# Altium schematic sheet STM32.SchDoc
size A; SheetNumber: 4; SheetTotal: 5
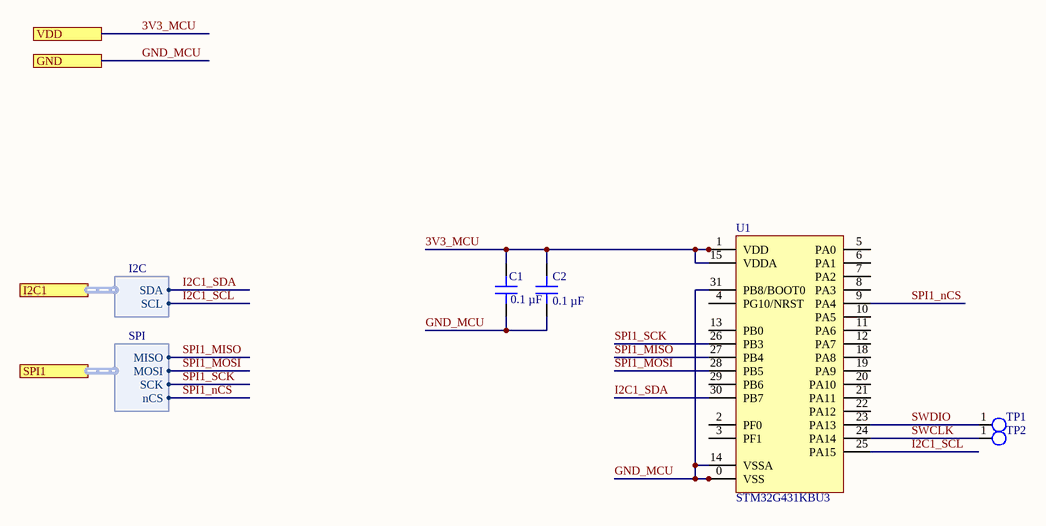
[diagram p0: STM32.SchDoc]

## Parts
C1  0.1 µF  [CAP 0402_1005]
C2  0.1 µF  [CAP 0402_1005]
TP1  0.8mm  [TP  0.8mm]  (value not drawn)
TP2  0.8mm  [TP  0.8mm]  (value not drawn)
U1  STM32G431KBU3  [QFN50P400X400X60-32N]

## Ports
GND, I2C1 (harness I2C), SPI1 (harness SPI), VDD

## Harnesses
I2C: SCL, SDA
SPI: MOSI, MISO, SCK, nCS

## Nets
3V3_MCU: C1.2 C2.2 U1.1(VDD) U1.15(VDDA) U1.17(VDD) ; port VDD
GND_MCU: C1.1 C2.1 U1.0(VSS) U1.14(VSSA) U1.16(VSS) U1.31(PB8/BOOT0) U1.32(VSS) ; port GND
I2C1_SCL: U1.25(PA15) ; port I2C1.SCL
I2C1_SDA: U1.30(PB7) ; port I2C1.SDA
SPI1_MISO: U1.27(PB4) ; port SPI1.MISO
SPI1_MOSI: U1.28(PB5) ; port SPI1.MOSI
SPI1_nCS: U1.9(PA4) ; port SPI1.nCS
SPI1_SCK: U1.26(PB3) ; port SPI1.SCK
SWCLK: TP2.1(TP) U1.24(PA14)
SWDIO: TP1.1(TP) U1.23(PA13)

Not connected (* = marked no-connect by the designer): U1 2(PF0) 3(PF1) 4(PG10/NRST) 5(PA0) 6(PA1) 7(PA2) 8(PA3) 10(PA5) 11(PA6) 12(PA7) 13(PB0) 18(PA8) 19(PA9) 20(PA10) 21(PA11) 22(PA12) 29(PB6)

## Library data of the parts
C1 C2 = C0402C104K4RACAUTO: CAP CER 0.1UF 16V X7R 0402; manufacturer: KEMET; Tolerance: ±10%; Part Number: C0402C104K4RACAUTO; Value: 0.1 µF; Applications: Automotive, Bypass, Decoupling; Capacitance: 0.1 µF; componentlink1description: Datasheet; componentlink1url: https://api.kemet.com/component-edge/download/specsheet/C0402C104K4RACAUTO.pdf; componentlink2description: DigiKey Link; componentlink2url: https://www.digikey.com/en/products/detail/kemet/C0402C104K4RACAUTO/3314827; Device Package: 0402 (1005 Metric); lastupdated: 8/14/2022 9:05:51 PM; Lifecycle Status: Active; Minimum Order: 1; Mounting Type: Surface Mount, MLCC; Operating Temperature: -55°C ~ 125°C; Package / Case: 0402 (1005 Metric); packaging: TapeAndReel; partid: 3024; Part Status: Active; price: 0.01; Ratings: AEC-Q200; series: SMD Auto X7R; Size / Dimension: 0.039" L x 0.020" W (1.00mm x 0.50mm); Supplier 1: DigiKey; Supplier Part Number 1: 399-6828-1-ND; Temperature Coefficient: X7R; Thickness (Max): 0.022" (0.55mm); Voltage - Rated: 16V
TP1 TP2 = TP 0.8mm: Test point
U1 = STM32G431KBU3: MCU UFQFPN-32